# EAGLE design 453_mic (EAGLE 9.1.1)
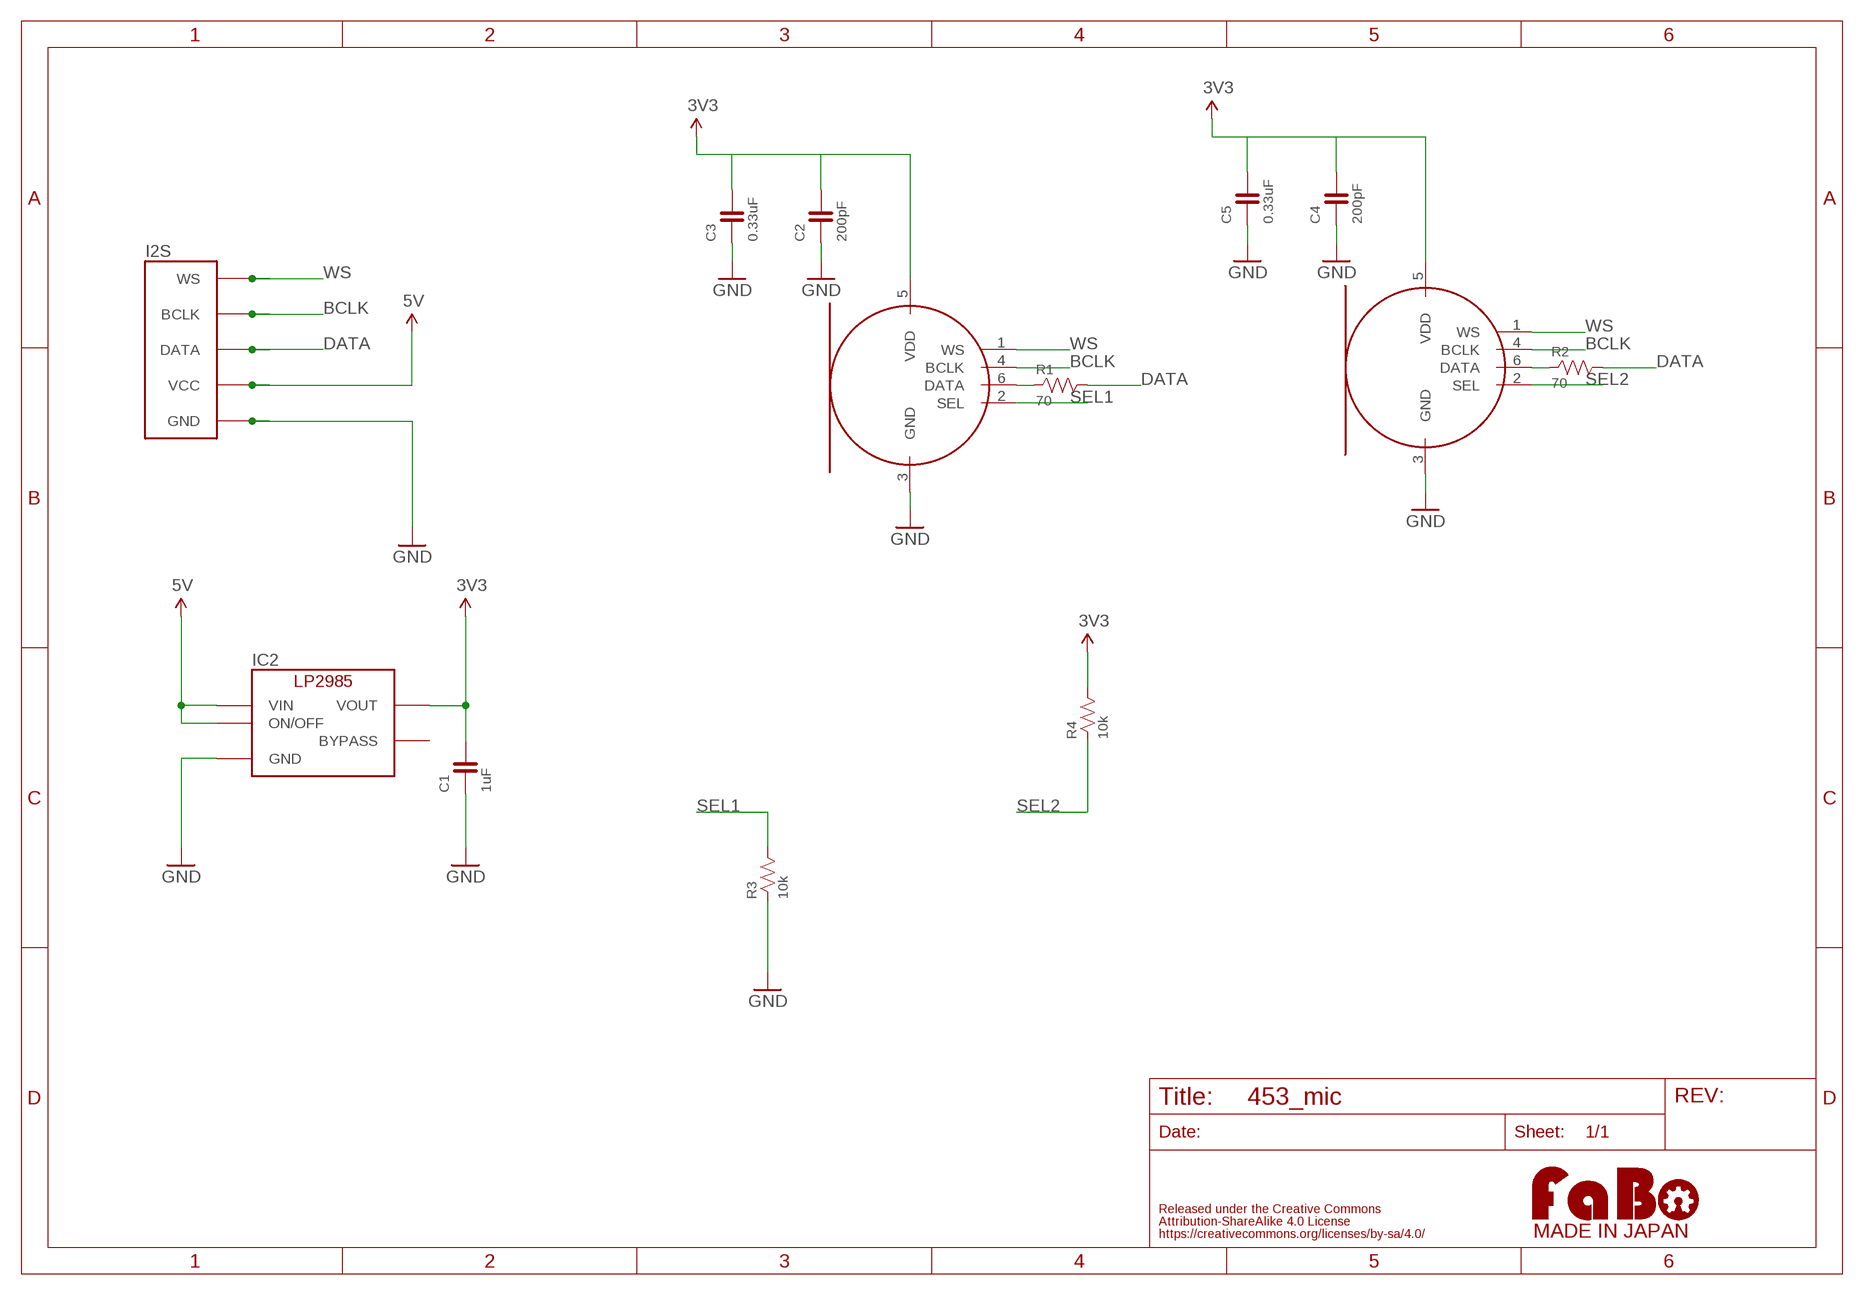
[diagram p0: schematic, sheet 1]

## Parts
C1  1uF  CAPACITOR-0603  [0603]
C2  200pF  CAPACITOR-0603  [0603]
C3  0.33uF  CAPACITOR-0603  [0603]
C4  200pF  CAPACITOR-0603  [0603]
C5  0.33uF  CAPACITOR-0603  [0603]
I2S  FABO_BRICK_I2SLONG  [FABO_BRICK_I2S_S05B-PASK-2_LONG]
IC2  LP2985-33DBV  [SOT-23-5]
MIC1  KW-SPH0645  [KNOWLES-SPH0645]
MIC2  KW-SPH0645  [KNOWLES-SPH0645]
R1  70  RESISTOR-0603  [0603]
R2  70  RESISTOR-0603  [0603]
R3  10k  RESISTOR-0603  [0603]
R4  10k  RESISTOR-0603  [0603]
U$3  LOGO_FABO-M_BOTTOM  [LOGO_FABO_MS_BOTTOM]

## Nets
3V3: C1.2 C2.2 C3.2 C4.2 C5.2 IC2.5(VOUT) MIC1.5(VDD) MIC2.5(VDD) R4.2
5V: I2S.VCC IC2.1(VIN) IC2.3(ON/OFF)
BCLK: I2S.BCLK MIC1.4(BCLK) MIC2.4(BCLK)
DATA: I2S.DATA R1.2 R2.2
GND: C1.1 C2.1 C3.1 C4.1 C5.1 I2S.GND IC2.2(GND) MIC1.3(GND) MIC2.3(GND) R3.1
N$1: MIC2.6(DATA) R2.1
N$6: MIC1.6(DATA) R1.1
SEL1: MIC1.2(SEL) R3.2
SEL2: MIC2.2(SEL) R4.1
WS: I2S.WS MIC1.1(WS) MIC2.1(WS)
Unconnected: IC2.4(BYPASS)

## Library data of the parts
C1-C5 = FaBo-Capacitor:CAPACITOR: CAPACITOR
I2S = FaBo-Template:FABO_BRICK_I2S
IC2 = FaBo-Supply:LP2985: LP2985
MIC1 MIC2 = FaBo-Mems:KW-SPH0645
R1-R4 = FaBo-Resistors:RESISTOR: RESISTOR
U$3 = FaBo-etc:LOGO_FABO

## Board
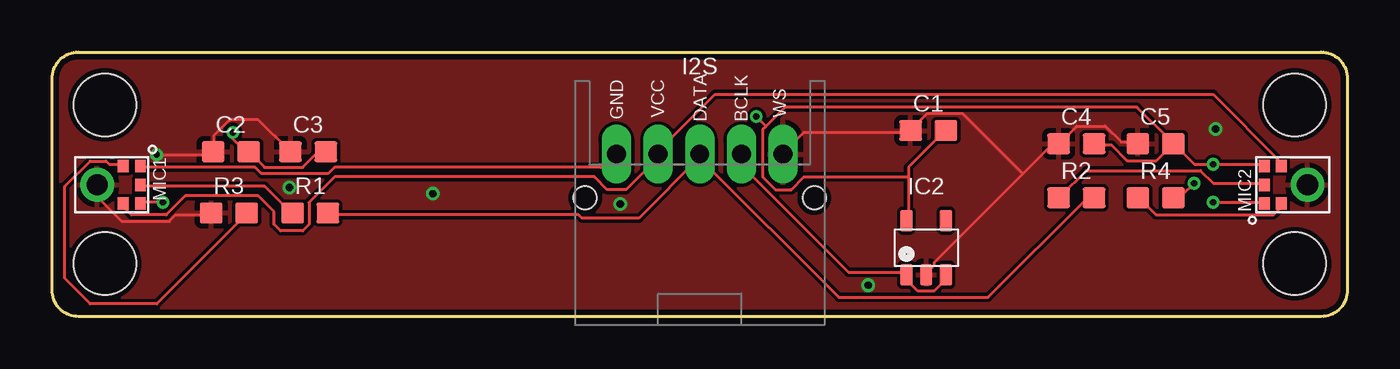
[diagram p1: board, top side]
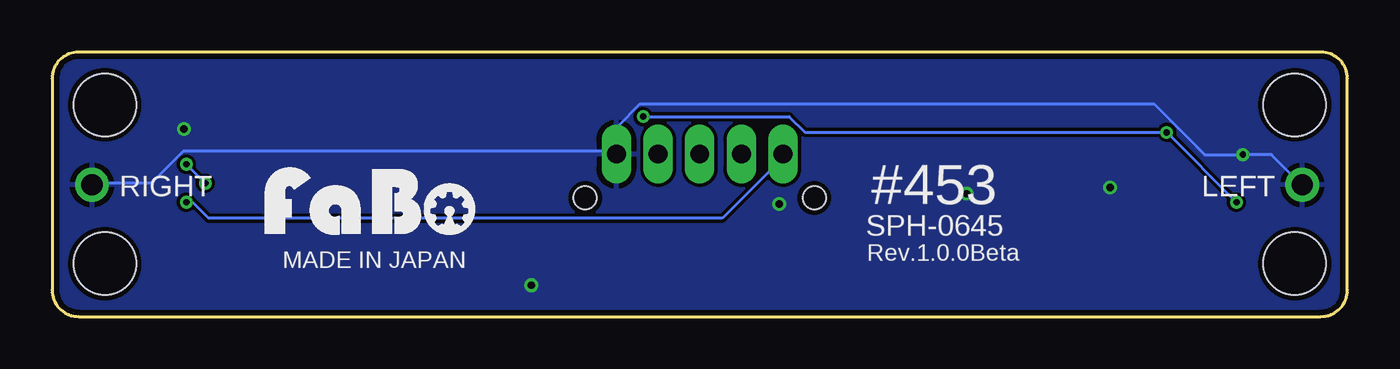
[diagram p2: board, bottom side, seen from below]

Size 62.23 x 12.7 mm. Coordinates in mm from the lower left corner, seen from the top.
Outline: 1.27,12.7 60.96,12.7 arc-90 62.23,11.43 62.23,1.27 arc-90 60.96,0 1.27,0 arc-90 0,1.27 0,11.43 arc-90 1.27,12.7
Copper layers (1*16): Top 0.035mm / dielectric 1.5mm / Bottom 0.035mm
Design rules "Elecrow_angle": minimum track width 6mil, minimum drill 12mil, track to track 6mil, track to pad 6mil, pad to pad 6mil, via to via 6mil, smd to smd 0mil, copper to edge 10mil, drill to drill 10mil, minimum pad ring 10mil, minimum via ring 6mil, stop-mask expansion 2mil, vias tented up to drill 100mil, thermal gap 10mil
Holes 3 mm at 2.54,10.16 2.54,2.54 59.69,10.16 59.69,2.54

### Footprints (pad centres in the part's own frame; a part is rotated, then mirrored left to right if it is on the bottom)
0603 = smd 1.1 x 1: 1 -0.85,0; 2 0.85,0
FABO_BRICK_I2S_S05B-PASK-2_LONG = drill 0.9 pad 1.422 long: BCLK 3,0; DATA 1,0; GND -3,0; VCC -1,0; WS 5,0 | hole 1.1: 6.5,2.1; -4.5,2.1
SOT-23-5 = smd 0.6 x 1.05: 1 -0.95,-1.3; 2 0,-1.3; 3 0.95,-1.3; 4 0.95,1.3; 5 -0.95,1.3
KNOWLES-SPH0645 = smd 0.6 x 0.522: 1 -0.9,2.074; 2 -0.9,1.252; 4 0.9,1.252; 5 0.9,2.074; 6 0,2.074 | drill 1.024 pad 1.624: 3 0,0

### Placement (x,y rotation side)
C1  42.09,8.93 0 top
C2  8.6,7.92 0 top
C3  12.3,7.92 0 top
C4  49.21,8.3 0 top
C5  53.01,8.3 0 top
I2S  32.12,7.8 180 top
IC2  41.99,3.31 0 top
MIC1  2.17,6.33 270 top
MIC2  60.31,6.33 90 top
R1  12.4,4.97 0 top
R2  49.21,5.7 0 top
R3  8.49,4.97 0 top
R4  53.01,5.7 0 top
U$3  46.95,3.54 0 top

### Tracks (layer width: path | path; a pad name or v marks a point on that pad's centre or on a via)
3V3  (via drill 0.3)
  Top 0.152: v5.33,5.49 4.27,5.49 MIC1.5 | v8.69,8.84 8.69,8.53 9.3,7.92 C2.2 10.21,7.16 12.04,7.16 12.65,7.77 13.11,7.77 C3.2 | 41.15,6.71 41.15,7.16 42.82,8.84 C1.2 | 41.15,6.71 41.15,4.72 IC2.5 | MIC2.5 58.22,7.32 v55.78,7.32 54.86,7.32 53.95,8.23 C5.2 | C4.2 50.14,8.23 50.9,8.23 51.66,7.47 53.03,7.47 53.8,8.23 C5.2 | v54.86,6.4 54.25,5.79 53.95,5.79 R4.2 | 41.15,6.71 36.12,6.71 35.51,6.1 34.75,6.1 34.14,6.71 34.14,8.99 34.29,9.14 | 34.29,9.14 35.2,10.06 52.12,10.06 53.8,8.38 C5.2 | 34.29,9.14 v33.83,9.6
  Bottom 0.152: v5.33,5.49 v8.69,8.84 26.06,8.84 26.82,9.6 v33.83,9.6 | v55.78,7.32 v54.86,6.4
5V
  Top 0.152: IC2.3 42.82,1.98 42.82,1.68 42.37,1.22 41.6,1.22 41.15,1.68 41.15,1.98 IC2.1 41,2.13 38.25,2.13 33.22,7.16 33.22,7.77 I2S.VCC
BCLK
  Top 0.152: MIC1.4 3.5,5.33 3.5,5.18 3.81,4.88 5.49,4.88 6.4,5.79 9.91,5.79 10.67,5.03 10.67,4.42 10.97,4.12 12.04,4.12 12.34,4.42 12.34,5.49 13.56,6.71 26.06,6.71 26.67,6.1 27.58,6.1 29.26,7.77 I2S.BCLK 29.11,7.92 31.85,10.67 55.78,10.67 58.98,7.47 58.98,7.32 MIC2.4
DATA
  Top 0.152: 31.09,7.62 31.24,7.77 I2S.DATA 31.09,7.62 | 31.09,7.62 28.19,4.72 25.45,4.72 25.3,4.88 13.26,4.88 R1.2 | 31.09,7.62 37.8,0.91 44.96,0.91 49.68,5.64 49.99,5.64 R2.2
GND  (via drill 0.3, 0.35)
  Top 0.152: 46.63,6.86 48.01,8.23 48.31,8.23 C4.1 48.46,8.38 49.23,9.14 50.6,9.14 51.36,8.38 52.12,8.38 C5.1 | 46.63,6.86 42.37,2.59 42.37,2.44 42.06,2.13 IC2.2 | C3.1 11.43,7.92 9.91,9.45 8.53,9.45 7.77,8.69 7.77,7.92 C2.1 7.62,7.77 v5.03,7.77 | R3.1 7.62,4.88 5.94,4.88 5.64,4.57 3.35,4.57 2.29,5.64 2.29,6.25 MIC1.3 | I2S.GND 35.2,7.92 36.12,8.84 41.15,8.84 C1.1 41.3,8.99 42.06,9.75 43.74,9.75 46.63,6.86
  Bottom 0.152: MIC1.3 2.29,6.4 3.66,7.77 v5.03,7.77 6.86,7.77 9.3,10.21 33.98,10.21 35.05,9.14 35.05,7.92 I2S.GND 35.2,7.92 55.93,7.92 57.45,6.4 60.2,6.4 MIC2.3
  other vias: 18.3,5.9 27.3,5.4 55.9,9 39.2,1.5 11.4,6.2
  pour Bottom: 0,0 0,12.7 62.23,12.7 62.23,0
  pour Top: 0,0 0,12.7 62.23,12.7 62.23,0
N$1
  Top 0.152: MIC2.6 58.22,6.4 55.78,6.4 55.17,7.01 49.68,7.01 48.46,5.79 R2.1
N$6
  Top 0.152: MIC1.6 4.27,6.25 10.21,6.25 11.43,5.03 R1.1
SEL1
  Top 0.152: MIC1.2 3.35,7.32 2.74,7.32 2.59,7.47 1.83,7.47 0.61,6.25 0.61,1.83 1.83,0.61 5.03,0.61 9.3,4.88 R3.2
SEL2
  Top 0.152: MIC2.2 58.98,5.33 58.98,5.18 58.67,4.88 53.03,4.88 52.27,5.64 R4.1
WS  (via drill 0.3)
  Top 0.152: MIC1.1 4.27,7.16 9.75,7.16 10.06,6.86 13.26,6.86 13.56,7.16 26.36,7.16 26.98,7.77 I2S.WS | v55.78,5.49 58.22,5.49 MIC2.1
  Bottom 0.152: v55.78,5.49 55.47,5.49 54.71,4.72 30.02,4.72 26.98,7.77 I2S.WS

### Text on the board
tPlace: VCC | WS | GND | DATA | BCLK
bPlace: LEFT | #453 | RIGHT | SPH-0645 | Rev.1.0.0Beta | MADE IN JAPAN